# Altium project EL.T01.MBRD.PrjPcb (part 2 of 2)

## Sheet WideRangeVoltmeter.SchDoc
size A4; SheetNumber: 8; SheetTotal: 8
Used 2 times, as channels Voltmetr, CellVoltage/Voltmetr. Parts and nets are listed once, with the designators drawn on the sheet.
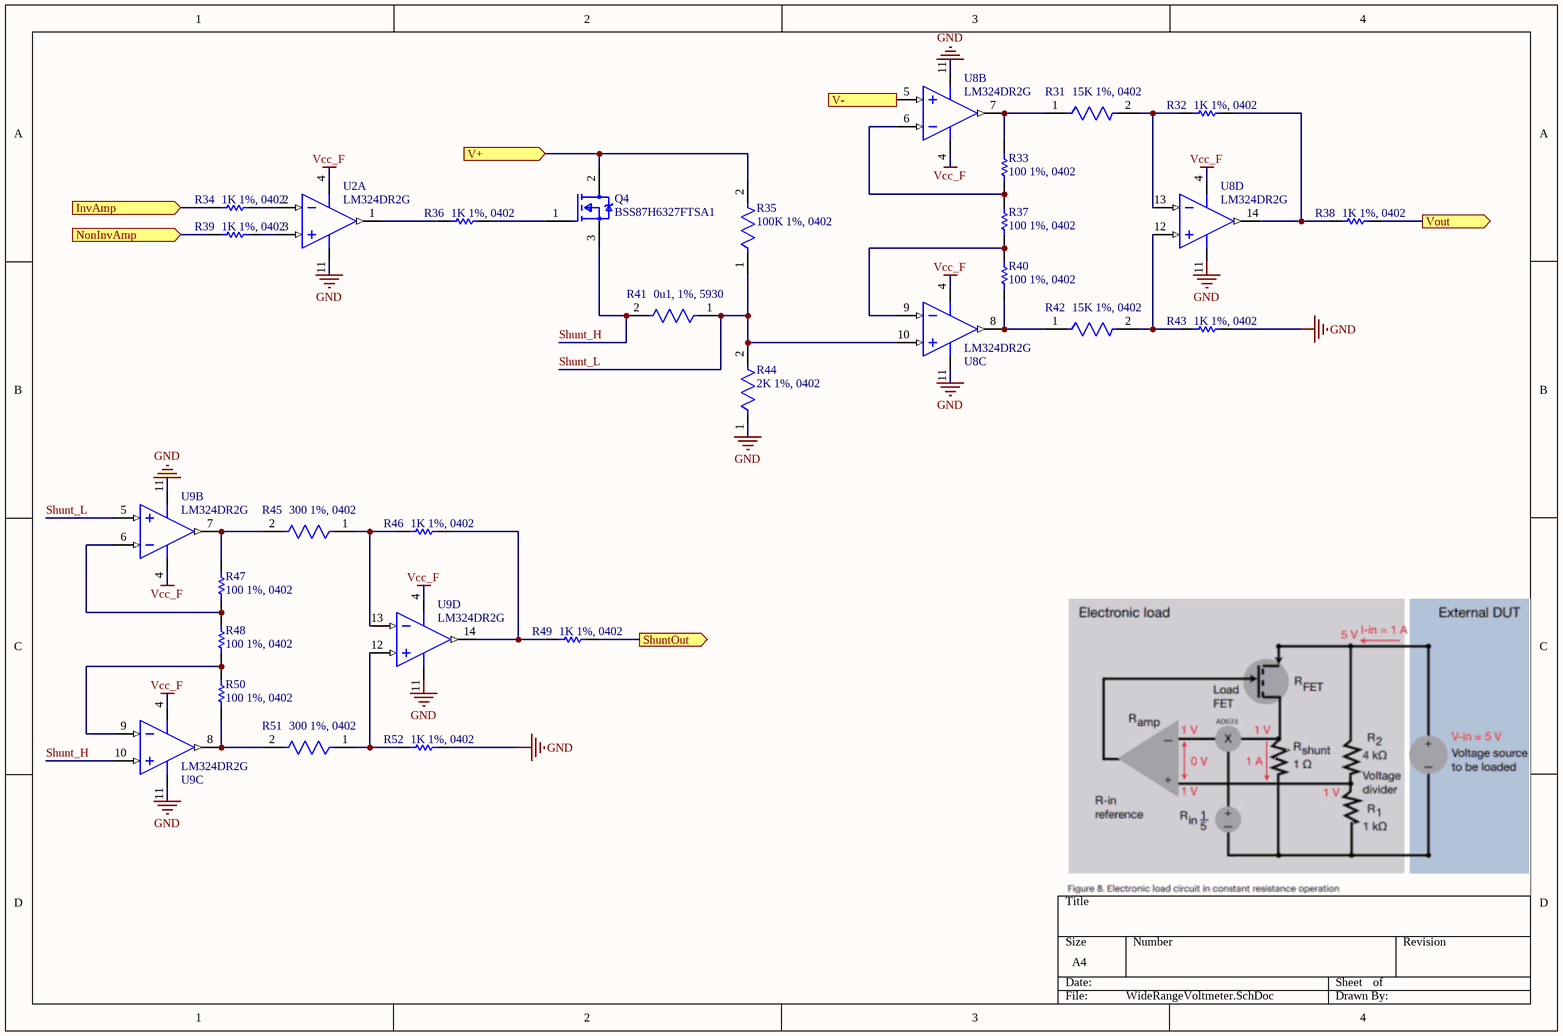
[diagram p4: WideRangeVoltmeter.SchDoc]

### Parts
Q4  BSS87H6327FTSA1  [FP-PG-SOT89-4-MFG]
R31  15K 1%, 0402  [FP-ERJ2R-MFG]
R32  1K 1%, 0402  [RESC1005X40X25NL05T05]
R33  100 1%, 0402  [RESC1005X40X25LL05T05]
R34  1K 1%, 0402  [RESC1005X40X25NL05T05]
R35  100K 1%, 0402  [FP-ERJ2RK-IPC_C]
R36  1K 1%, 0402  [RESC1005X40X25NL05T05]
R37  100 1%, 0402  [RESC1005X40X25LL05T05]
R38  1K 1%, 0402  [RESC1005X40X25NL05T05]
R39  1K 1%, 0402  [RESC1005X40X25NL05T05]
R40  100 1%, 0402  [RESC1005X40X25LL05T05]
R41  0u1, 1%, 5930  [FP-CSS2H-5930K-1L00F-MFG]
R42  15K 1%, 0402  [FP-ERJ2R-MFG]
R43  1K 1%, 0402  [RESC1005X40X25NL05T05]
R44  2K 1%, 0402  [FP-ERJ2RK-MFG]
R45  300 1%, 0402  [FP-ERJ2RK-IPC_A]
R46  1K 1%, 0402  [RESC1005X40X25NL05T05]
R47  100 1%, 0402  [RESC1005X40X25LL05T05]
R48  100 1%, 0402  [RESC1005X40X25LL05T05]
R49  1K 1%, 0402  [RESC1005X40X25NL05T05]
R50  100 1%, 0402  [RESC1005X40X25LL05T05]
R51  300 1%, 0402  [FP-ERJ2RK-IPC_A]
R52  1K 1%, 0402  [RESC1005X40X25NL05T05]
U2  LM324DR2G  [ONSC-SOIC-14-751A-03_V]  (part A of 4)
U8  LM324DR2G  [ONSC-SOIC-14-751A-03_V]  (parts B,C,D of 4)
U9  LM324DR2G  [ONSC-SOIC-14-751A-03_V]  (parts B,C,D of 4)

### Ports
InvAmp (in, see MainBoard[2A], CellVoltageControl[1C]), NonInvAmp (in, see MainBoard[2A], CellVoltageControl[1C]), ShuntOut (out), V+ (in, see MainBoard[3A]), V- (in, see MainBoard[3A]), Vout (out, see MainBoard[3A], CellVoltageControl[2B])

### Nets
GND: R43.2 R44.1 R52.2 U2.11(VEE/GND) U8.11(VEE/GND) U9.11(VEE/GND)
Vcc_F: U2.4(VCC) U8.4(VCC) U9.4(VCC)
InvAmp: R34.1 ; port InvAmp
NonInvAmp: R39.1 ; port NonInvAmp
Shunt_H: Q4.3(Source) R41.2 U9.10(IN3+)
Shunt_L: R35.1 R41.1 R44.2 U8.10(IN3+) U9.5(IN2+)
ShuntOut: R49.2 ; port ShuntOut
V+: Q4.2(Drain) R35.2 ; port V+
V-: U8.5(IN2+) ; port V-
Vout: R38.2 ; port Vout
NetQ4_1: Q4.1(Gate) R36.2
NetR31_1: R31.1 R33.2 U8.7(OUT2)
NetR31_2: R31.2 R32.1 U8.13(IN4-)
NetR32_2: R32.2 R38.1 U8.14(OUT4)
NetR33_1: R33.1 R37.2 U8.6(IN2-)
NetR34_2: R34.2 U2.2(IN1-)
NetR36_1: R36.1 U2.1(OUT1)
NetR37_1: R37.1 R40.2 U8.9(IN3-)
NetR39_2: R39.2 U2.3(IN1+)
NetR40_1: R40.1 R42.1 U8.8(OUT3)
NetR42_2: R42.2 R43.1 U8.12(IN4+)
NetR45_1: R45.1 R46.1 U9.13(IN4-)
NetR45_2: R45.2 R47.2 U9.7(OUT2)
NetR46_2: R46.2 R49.1 U9.14(OUT4)
NetR47_1: R47.1 R48.2 U9.6(IN2-)
NetR48_1: R48.1 R50.2 U9.9(IN3-)
NetR50_1: R50.1 R51.2 U9.8(OUT3)
NetR51_1: R51.1 R52.1 U9.12(IN4+)

### Channels
Voltmetr: designators end in _Voltmetr; ports InvAmp=NetR34_Voltmetr_1 NonInvAmp=NetR39_Voltmetr_1 ShuntOut=NetR49_Voltmetr_2 V+=NetQ4_Voltmetr_2 V-=NetU8_Voltmetr_5 Vout=NetR38_Voltmetr_2
CellVoltage/Voltmetr: designators end in _CellVoltage_Voltmetr; ports InvAmp=NetR34_CellVoltage_Voltmetr_1 NonInvAmp=NetR39_CellVoltage_Voltmetr_1 ShuntOut=NetR49_CellVoltage_Voltmetr_2 V+=V+ V-=GND Vout=NetR38_CellVoltage_Voltmetr_2

### Notes on the sheet
- Labels drawn without touching a wire or pin: GND

### Library data of the parts
Q4 = CMP-32901-001322-1: MOSFET N-CH 240V 260MA SOT89-4; Input Capacitance: 97pF; Drain to Source Resistance: 3.9R; Rise Time: 3.5ns; Rds On Max: 6R; Fall Time: 27.3ns; Turn-On Delay Time: 3.7ns; Number of Elements: 1; Power Dissipation: 1W; Element Configuration: Single; Gate to Source Voltage (Vgs): 20V; Polarity: N-CHANNEL; Turn-Off Delay Time: 17.6ns; Case/Package: SOT-89; Max Dual Supply Voltage: 240V; Drain to Source Voltage (Vdss): 240V; Lead Free: Lead Free; Package Quantity: 1000; Halogen Free: Not Halogen Free; RoHS Compliant: Yes; Width: 2.5mm; Length: 4.5mm; Mount: Surface Mount; Packaging: Tape and Reel; Max Power Dissipation: 1W; Height: 1.5mm; Max Operating Temperature: 150°C; Series: SIPMOS®; Drain to Source Breakdown Voltage: 240V; Min Operating Temperature: -55°C; Number of Pins: 3; Continuous Drain Current (ID): 260mA
R31 R42 = CMP-2002-00694-4: RES SMD 15K OHM 1% 1/10W 0402; Manufacturer Part Number: ERJ-2RKF1502X; Manufacturer: Panasonic; Automotive Grade: Grade 0; Voltage Rating: 50V; Resistance: 15kΩ; Temperature Coefficient: 100ppm/°C; Power Rating: 0.1W; Value: 15kΩ; ComponentLink2URL: https://industrial.panasonic.com/cdbs/www-data/pdf/RDA0000/AOA0000C304.pdf; Automotive: Yes; Temperature: -55°C to +155°C; Height: 0.4mm; Digikey Description: RES SMD 15K OHM 1% 1/10W 0402; Category: Res; Device Class L2: Resistors; Device Class L1: Passive Components; Package: ERJ2R; Temperature Range Low: -55°C; Tolerance: 1%; Series: ERJ; Footprint Url: https://b2b-api.panasonic.eu/file_stream/pids/fileversion/1180; Mouser Description: Res Thick Film 1.0 x 0.5 mm 15K Ohm 1% 0.1W(1/10W) 100ppm/ C Molded SMD Punched Carrier T/R; Composition: Thick Film; Lead Free: Yes; Device Class L3: Chip SMD Resistors; Octopart: https://octopart.com/erj-2rkf1502x-panasonic-55404985; RoHS: TRUE; Temperature Range High: +155°C; ComponentLink2Description: Datasheet
R32 R34 R36 R38 R39 R43 R46 R49 R52 = CMP-1011-00510-4: Chip Resistor, 1 KOhm, +/- 1%, 100 mW, -55 to 155 degC, 0402 (1005 Metric), RoHS, Tape and Reel; PartNumber: ERJ-2RKF1001X; Manufacturer: Basic Passives; Voltage Rating: 50 V; Case\/Package: 0402; Resistance: 1 KOhm; Power Rating: 100 mW; DatasheetVersion: 04/2015; Radiation Hardening: No; Pins: 2; Height: 0.35 mm; RoHSCompliant: true; Case Code (Imperial): 0402; ComponentLink2Description: Datasheet; ComponentLink1Description: Manufacturer URL; PackageReference: 0402; Mount: Surface Mount; Package Quantity: 10000; Tolerance: 1%; ComponentLink1URL: http://www.panasonic.com/; PackageDescription: 2-Pin Surface Mount Device, Body 1 x 0.5 mm; Mounting Technology: Surface Mount; Case Code (Metric): 1005; ComponentLink2URL: http://industrial.panasonic.com/cdbs/www-data/pdf/RDA0000/AOA0000C86.pdf; REACH SVHC: Yes; Packaging: Tape and Reel; Max Operating Temperature: 155 degC; Min Operating Temperature: -55 degC; Width: 0.5 mm; Length: 1 mm
R33 R37 R40 R47 R48 R50 = CMP-2002-00605-3: Chip Resistor, 100 Ohm, +/- 1%, 100 mW, -55 to 155 degC, 0402 (1005 Metric), RoHS, Tape and Reel; Manufacturer: Basic Passives; PartNumber: ERJ-2RKF1000X; Power Rating: 100 mW; Resistance: 100 Ohm; Voltage Rating: 50 V; Case\/Package: 0402; Width: 0.5 mm; Pins: 2; ComponentLink2Description: Datasheet; PackageReference: 0402; Height: 0.35 mm; Tolerance: 1%; DatasheetVersion: 04/2015; Case Code (Imperial): 0402; Min Operating Temperature: -55 degC; Radiation Hardening: No; Length: 1 mm; Package Quantity: 10000; PackageDescription: 2-Pin Surface Mount Device, Body 1 x 0.5 mm; Mounting Technology: Surface Mount; Case Code (Metric): 1005; Packaging: Tape and Reel; ComponentLink1URL: http://www.panasonic.com/; RoHSCompliant: true; Max Operating Temperature: 155 degC; REACH SVHC: Yes; ComponentLink1Description: Manufacturer URL; ComponentLink2URL: http://industrial.panasonic.com/cdbs/www-data/pdf/RDA0000/AOA0000C86.pdf; Mount: Surface Mount
R35 = CMP-2002-00608-4: RES SMD 100K OHM 1% 1/10W 0402; Resistance: 100kR; Voltage Rating (DC): 50V; Power Rating: 100mW; Temperature Coefficient: 100ppm/°C; Case/Package: 0402; Length: 1mm; Package Quantity: 1; Radiation Hardening: No; Case Code (Metric): 1005; Contact Plating: Tin; Mount: Surface Mount; Depth: 0.5mm; Max Operating Temperature: 155°C; Lead Free: Lead Free; Width: 0.5mm; Composition: Thick Film; Case Code (Imperial): 0402; Tolerance: 1%; Termination: SMD/SMT; Number of Pins: 2; Height: 0.35mm; Voltage Rating: 50V; Military Standard: Not; REACH SVHC: No SVHC; Packaging: Tape and Reel; Min Operating Temperature: -55°C; Max Power Dissipation: 100mW; Features: Automotive AEC-Q200; Number of Terminations: 2
R41 = CMP-00059-73869598-1: CSS2H-5930K-1L00F Res Metal Strip 5930 0.001 Ohm 1% 9W ±50ppm/C Pad SMD Automotive T/R; Resistance: 1mΩ; Temperature Coefficient: 50ppm/°C; Case Code (Imperial): 5931; Width: 7.747mm; Min Operating Temperature: -55°C; Tolerance: 1%; Max Power Dissipation: 9W; Case Code (Metric): 1577; Max Operating Temperature: 170°C; NexarPartId: 73869598; Power Rating: 9W; Composition: Metal Element; Case/Package: 5930; Height: 939.8µm; Number of Terminations: 2; Schedule B: 8533210045, 8533210045; Packaging: Cut Tape; REACH SVHC: No SVHC; Features: Moisture Resistant; RoHS: Compliant; Length: 15.0114mm
R44 = CMP-2002-00758-4: RES SMD 2K OHM 1% 1/10W 0402; Temperature Coefficient: 100ppm/°C; Max Power Dissipation: 100mW; Working Voltage: 50V; Resistance: 2kR; Number of Terminations: 2; Technology: THICK FILM; Packaging: Tape and Reel; RoHS Compliant: Yes; Min Operating Temperature: -55°C; Length: 1mm; Construction: Rectangular; Features: Automotive AEC-Q200; Contact Plating: Tin; Lead Free: Lead Free; Series: ERJ; Power Rating: 100mW; REACH SVHC: No SVHC; Resistor Type: Thick Film; Max Operating Temperature: 155°C; Package Quantity: 10000; Height: 0.35mm; Case/Package: 0402; Tolerance: 1%; Mount: Surface Mount; Termination: SMD/SMT; Resistance Tolerance: 1%; Depth: 0.5mm; Voltage Rating (DC): 50V; Voltage Rating: 50V; Case Code (Imperial): 0402; Military Standard: Not; Width: 0.02inch; Radiation Hardening: No; Case Code (Metric): 1005
R45 R51 = CMP-1011-00449-3: RES SMD 300 OHM 1% 1/10W 0402; Power Rating: 100mW; Voltage Rating: 50V; Temperature Coefficient: 100ppm/°C; Resistance: 300R; Case Code (Imperial): 0402; Termination: SMD/SMT; REACH SVHC: No SVHC; Number of Terminations: 2; Composition: Thick Film; Case Code (Metric): 1005; Voltage Rating (DC): 50V; Packaging: Tape and Reel; Max Power Dissipation: 100mW; Tolerance: 1%; Lead Free: Lead Free; Military Standard: Not; Mount: Surface Mount; Height: 0.35mm; Package Quantity: 10000; Max Operating Temperature: 155°C; Depth: 0.5mm; Min Operating Temperature: -55°C; Length: 1mm; Contact Plating: Tin; Width: 0.02inch; Case/Package: 0402
U2 U8 U9 = CMP-1310-00171-1: Single Supply Quad Operational Amplifier, 3 to 32 V, 0 to 70 degC, 14-Pin SOIC, Pb-Free, Tape and Reel; Manufacturer: On Semiconductor; VCC Max (V): 32; VCC Min (V): 3; PackageVersion: Rev. K, 05/2011; ComponentLink3URL: http://www.onsemi.com/pub_link/Collateral/751A-03.PDF; ComponentLink3Description: Package Specification; Packing: Tape and Reel; ComponentLink2URL: http://www.onsemi.cn/pub_link/Collateral/LM324-D.PDF; PackageReference: SOIC-14-751A-03; ComponentLink1URL: http://www.onsemi.com/; PackageDescription: 14-Pin Small Outline Integrated Circuit, Body 8.65 x 3.9 mm, Pitch 1.27 mm; ComponentLink1Description: Manufacturer URL; DatasheetVersion: Rev. 25; Mounting Technology: Surface Mount; RoHS: TRUE; ComponentLink2Description: Datasheet; PartNumber: LM324DR2G

## Sheet CellVoltageControl.SchDoc
size A4; SheetNumber: 5; SheetTotal: 8
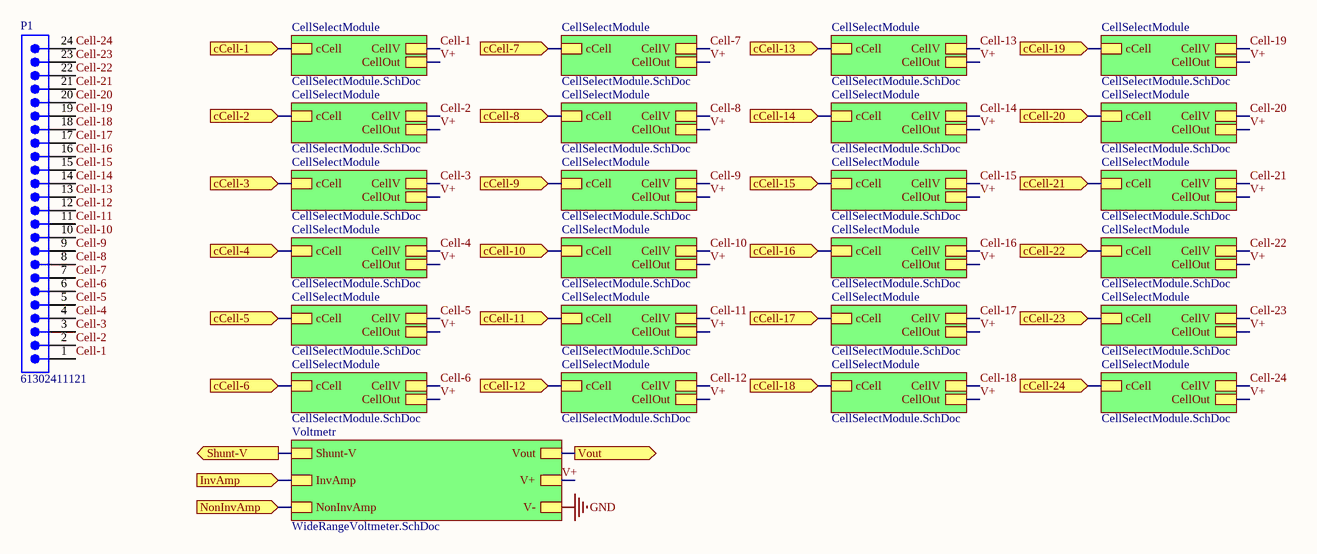
[diagram p5: CellVoltageControl.SchDoc]

### Parts
P1  61302411121  [61302411121]

### Sub-sheets
CellSelectModule = CellSelectModule.SchDoc: cCell, CellV, CellOut
CellSelectModule = CellSelectModule.SchDoc: cCell, CellV, CellOut
CellSelectModule = CellSelectModule.SchDoc: cCell, CellV, CellOut
CellSelectModule = CellSelectModule.SchDoc: cCell, CellV, CellOut
CellSelectModule = CellSelectModule.SchDoc: cCell, CellV, CellOut
CellSelectModule = CellSelectModule.SchDoc: cCell, CellV, CellOut
CellSelectModule = CellSelectModule.SchDoc: cCell, CellV, CellOut
CellSelectModule = CellSelectModule.SchDoc: cCell, CellV, CellOut
CellSelectModule = CellSelectModule.SchDoc: cCell, CellV, CellOut
CellSelectModule = CellSelectModule.SchDoc: cCell, CellV, CellOut
CellSelectModule = CellSelectModule.SchDoc: cCell, CellV, CellOut
CellSelectModule = CellSelectModule.SchDoc: cCell, CellV, CellOut
CellSelectModule = CellSelectModule.SchDoc: cCell, CellV, CellOut
CellSelectModule = CellSelectModule.SchDoc: cCell, CellV, CellOut
CellSelectModule = CellSelectModule.SchDoc: cCell, CellV, CellOut
CellSelectModule = CellSelectModule.SchDoc: cCell, CellV, CellOut
CellSelectModule = CellSelectModule.SchDoc: cCell, CellV, CellOut
CellSelectModule = CellSelectModule.SchDoc: cCell, CellV, CellOut
CellSelectModule = CellSelectModule.SchDoc: cCell, CellV, CellOut
CellSelectModule = CellSelectModule.SchDoc: cCell, CellV, CellOut
CellSelectModule = CellSelectModule.SchDoc: cCell, CellV, CellOut
CellSelectModule = CellSelectModule.SchDoc: cCell, CellV, CellOut
CellSelectModule = CellSelectModule.SchDoc: cCell, CellV, CellOut
CellSelectModule = CellSelectModule.SchDoc: cCell, CellV, CellOut
Voltmetr = WideRangeVoltmeter.SchDoc: InvAmp, NonInvAmp, V-, V+, Shunt-V, Vout

### Ports
cCell-1 (in, see MainBoard[3A]), cCell-2 (in, see MainBoard[3A]), cCell-3 (in, see MainBoard[3A]), cCell-4 (in, see MainBoard[3A]), cCell-5 (in, see MainBoard[3A]), cCell-6 (in, see MainBoard[3A]), cCell-7 (in, see MainBoard[3A]), cCell-8 (in, see MainBoard[3A]), cCell-9 (in, see MainBoard[3A]), cCell-10 (in, see MainBoard[3A]), cCell-11 (in, see MainBoard[3A]), cCell-12 (in, see MainBoard[3A]), cCell-13 (in, see MainBoard[4A]), cCell-14 (in, see MainBoard[4A]), cCell-15 (in, see MainBoard[4A]), cCell-16 (in, see MainBoard[4A]), cCell-17 (in, see MainBoard[4A]), cCell-18 (in, see MainBoard[4A]), cCell-19 (in, see MainBoard[4A]), cCell-20 (in, see MainBoard[4A]), cCell-21 (in, see MainBoard[4A]), cCell-22 (in, see MainBoard[4A]), cCell-23 (in, see MainBoard[4A]), cCell-24 (in, see MainBoard[4A]), InvAmp (in, see MainBoard[3A], WideRangeVoltmeter[1A]), NonInvAmp (in, see MainBoard[3A], WideRangeVoltmeter[1A]), Shunt-V (out, see MainBoard[3A]), Vout (out, see MainBoard[4A], WideRangeVoltmeter[4A])

### Nets
Cell-1: P1.1 ; sheet CellSelectModule/CellV
Cell-2: P1.2 ; sheet CellSelectModule/CellV
Cell-3: P1.3 ; sheet CellSelectModule/CellV
Cell-4: P1.4 ; sheet CellSelectModule/CellV
Cell-5: P1.5 ; sheet CellSelectModule/CellV
Cell-6: P1.6 ; sheet CellSelectModule/CellV
Cell-7: P1.7 ; sheet CellSelectModule/CellV
Cell-8: P1.8 ; sheet CellSelectModule/CellV
Cell-9: P1.9 ; sheet CellSelectModule/CellV
Cell-10: P1.10 ; sheet CellSelectModule/CellV
Cell-11: P1.11 ; sheet CellSelectModule/CellV
Cell-12: P1.12 ; sheet CellSelectModule/CellV
Cell-13: P1.13 ; sheet CellSelectModule/CellV
Cell-14: P1.14 ; sheet CellSelectModule/CellV
Cell-15: P1.15 ; sheet CellSelectModule/CellV
Cell-16: P1.16 ; sheet CellSelectModule/CellV
Cell-17: P1.17 ; sheet CellSelectModule/CellV
Cell-18: P1.18 ; sheet CellSelectModule/CellV
Cell-19: P1.19 ; sheet CellSelectModule/CellV
Cell-20: P1.20 ; sheet CellSelectModule/CellV
Cell-21: P1.21 ; sheet CellSelectModule/CellV
Cell-22: P1.22 ; sheet CellSelectModule/CellV
Cell-23: P1.23 ; sheet CellSelectModule/CellV
Cell-24: P1.24 ; sheet CellSelectModule/CellV
V+: sheet Voltmetr/V+, sheet CellSelectModule/CellOut, sheet CellSelectModule/CellOut, sheet CellSelectModule/CellOut, sheet CellSelectModule/CellOut, sheet CellSelectModule/CellOut, sheet CellSelectModule/CellOut, sheet CellSelectModule/CellOut, sheet CellSelectModule/CellOut, sheet CellSelectModule/CellOut, sheet CellSelectModule/CellOut, sheet CellSelectModule/CellOut, sheet CellSelectModule/CellOut, sheet CellSelectModule/CellOut, sheet CellSelectModule/CellOut, sheet CellSelectModule/CellOut, sheet CellSelectModule/CellOut, sheet CellSelectModule/CellOut, sheet CellSelectModule/CellOut, sheet CellSelectModule/CellOut, sheet CellSelectModule/CellOut, sheet CellSelectModule/CellOut, sheet CellSelectModule/CellOut, sheet CellSelectModule/CellOut, sheet CellSelectModule/CellOut
NetR34_CellVoltage_Voltmetr_1: port InvAmp, sheet Voltmetr/InvAmp
NetR38_CellVoltage_Voltmetr_2: port Vout, sheet Voltmetr/Vout
NetR39_CellVoltage_Voltmetr_1: port NonInvAmp, sheet Voltmetr/NonInvAmp
NetR53_CellVoltage_CellSelectModule#1_2: port cCell-1, sheet CellSelectModule/cCell
NetR53_CellVoltage_CellSelectModule#2_2: port cCell-2, sheet CellSelectModule/cCell
NetR53_CellVoltage_CellSelectModule#3_2: port cCell-3, sheet CellSelectModule/cCell
NetR53_CellVoltage_CellSelectModule#4_2: port cCell-4, sheet CellSelectModule/cCell
NetR53_CellVoltage_CellSelectModule#5_2: port cCell-5, sheet CellSelectModule/cCell
NetR53_CellVoltage_CellSelectModule#6_2: port cCell-6, sheet CellSelectModule/cCell
NetR53_CellVoltage_CellSelectModule#7_2: port cCell-7, sheet CellSelectModule/cCell
NetR53_CellVoltage_CellSelectModule#8_2: port cCell-8, sheet CellSelectModule/cCell
NetR53_CellVoltage_CellSelectModule#9_2: port cCell-9, sheet CellSelectModule/cCell
NetR53_CellVoltage_CellSelectModule#10_2: port cCell-10, sheet CellSelectModule/cCell
NetR53_CellVoltage_CellSelectModule#11_2: port cCell-11, sheet CellSelectModule/cCell
NetR53_CellVoltage_CellSelectModule#12_2: port cCell-12, sheet CellSelectModule/cCell
NetR53_CellVoltage_CellSelectModule#13_2: port cCell-13, sheet CellSelectModule/cCell
NetR53_CellVoltage_CellSelectModule#14_2: port cCell-14, sheet CellSelectModule/cCell
NetR53_CellVoltage_CellSelectModule#15_2: port cCell-15, sheet CellSelectModule/cCell
NetR53_CellVoltage_CellSelectModule#16_2: port cCell-16, sheet CellSelectModule/cCell
NetR53_CellVoltage_CellSelectModule#17_2: port cCell-17, sheet CellSelectModule/cCell
NetR53_CellVoltage_CellSelectModule#18_2: port cCell-18, sheet CellSelectModule/cCell
NetR53_CellVoltage_CellSelectModule#19_2: port cCell-19, sheet CellSelectModule/cCell
NetR53_CellVoltage_CellSelectModule#20_2: port cCell-20, sheet CellSelectModule/cCell
NetR53_CellVoltage_CellSelectModule#21_2: port cCell-21, sheet CellSelectModule/cCell
NetR53_CellVoltage_CellSelectModule#22_2: port cCell-22, sheet CellSelectModule/cCell
NetR53_CellVoltage_CellSelectModule#23_2: port cCell-23, sheet CellSelectModule/cCell
NetR53_CellVoltage_CellSelectModule#24_2: port cCell-24, sheet CellSelectModule/cCell
(unnamed): port Shunt-V, sheet Voltmetr/Shunt-V

### Library data of the parts
P1 = CMP-1502-01109-3: NexarPartId: 32855561; Pitch: 2.54mm; Contact Resistance: 20mΩ; Operating Supply Voltage: 250V; Current Rating: 3A; Gender: Male; Connector Type: Male Pin; Number of Positions: 24; Packaging: Bulk; Lead Pitch: 2.54mm; Number of Pins: 24; Orientation: Vertical; Contact Material: Copper; REACH SVHC: Unknown; Color: Black; Mount: Through Hole; Contact Plating: Gold; Contact Mating Length: 5.9944mm; RoHS: Compliant; Termination: Solder; Number of Rows: 1; Number of Contacts: 24

## Sheet CellSelectModule.SchDoc
size A4; SheetNumber: 3; SheetTotal: 8
Used 24 times, as channels CellVoltage/CellSelectModule, CellVoltage/CellSelectModule, CellVoltage/CellSelectModule, CellVoltage/CellSelectModule, CellVoltage/CellSelectModule, CellVoltage/CellSelectModule, CellVoltage/CellSelectModule, CellVoltage/CellSelectModule, CellVoltage/CellSelectModule, CellVoltage/CellSelectModule, CellVoltage/CellSelectModule, CellVoltage/CellSelectModule, CellVoltage/CellSelectModule, CellVoltage/CellSelectModule, CellVoltage/CellSelectModule, CellVoltage/CellSelectModule, CellVoltage/CellSelectModule, CellVoltage/CellSelectModule, CellVoltage/CellSelectModule, CellVoltage/CellSelectModule, CellVoltage/CellSelectModule, CellVoltage/CellSelectModule, CellVoltage/CellSelectModule, CellVoltage/CellSelectModule. Parts and nets are listed once, with the designators drawn on the sheet.
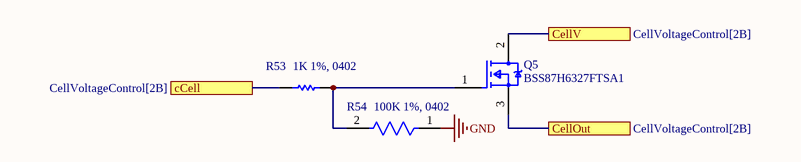
[diagram p6: CellSelectModule.SchDoc]

### Parts
Q5  BSS87H6327FTSA1  [FP-PG-SOT89-4-MFG]
R53  1K 1%, 0402  [RESC1005X40X25NL05T05]
R54  100K 1%, 0402  [FP-ERJ2RK-IPC_C]

### Ports
cCell (see CellVoltageControl[2B]), CellOut (see CellVoltageControl[2B]), CellV (see CellVoltageControl[2B])

### Nets
GND: R54.1
cCell: R53.2 ; port cCell
CellOut: Q5.3(Source) ; port CellOut
CellV: Q5.2(Drain) ; port CellV
NetQ5_1: Q5.1(Gate) R53.1 R54.2

### Channels
CellVoltage/CellSelectModule: designators end in _CellVoltage_CellSelectModule#1; ports cCell=NetR53_CellVoltage_CellSelectModule#1_2 CellOut=V+ CellV=Cell-1
CellVoltage/CellSelectModule: designators end in _CellVoltage_CellSelectModule#2; ports cCell=NetR53_CellVoltage_CellSelectModule#2_2 CellOut=V+ CellV=Cell-2
CellVoltage/CellSelectModule: designators end in _CellVoltage_CellSelectModule#3; ports cCell=NetR53_CellVoltage_CellSelectModule#3_2 CellOut=V+ CellV=Cell-3
CellVoltage/CellSelectModule: designators end in _CellVoltage_CellSelectModule#4; ports cCell=NetR53_CellVoltage_CellSelectModule#4_2 CellOut=V+ CellV=Cell-4
CellVoltage/CellSelectModule: designators end in _CellVoltage_CellSelectModule#5; ports cCell=NetR53_CellVoltage_CellSelectModule#5_2 CellOut=V+ CellV=Cell-5
CellVoltage/CellSelectModule: designators end in _CellVoltage_CellSelectModule#6; ports cCell=NetR53_CellVoltage_CellSelectModule#6_2 CellOut=V+ CellV=Cell-6
CellVoltage/CellSelectModule: designators end in _CellVoltage_CellSelectModule#7; ports cCell=NetR53_CellVoltage_CellSelectModule#7_2 CellOut=V+ CellV=Cell-7
CellVoltage/CellSelectModule: designators end in _CellVoltage_CellSelectModule#8; ports cCell=NetR53_CellVoltage_CellSelectModule#8_2 CellOut=V+ CellV=Cell-8
CellVoltage/CellSelectModule: designators end in _CellVoltage_CellSelectModule#9; ports cCell=NetR53_CellVoltage_CellSelectModule#9_2 CellOut=V+ CellV=Cell-9
CellVoltage/CellSelectModule: designators end in _CellVoltage_CellSelectModule#10; ports cCell=NetR53_CellVoltage_CellSelectModule#10_2 CellOut=V+ CellV=Cell-10
CellVoltage/CellSelectModule: designators end in _CellVoltage_CellSelectModule#11; ports cCell=NetR53_CellVoltage_CellSelectModule#11_2 CellOut=V+ CellV=Cell-11
CellVoltage/CellSelectModule: designators end in _CellVoltage_CellSelectModule#12; ports cCell=NetR53_CellVoltage_CellSelectModule#12_2 CellOut=V+ CellV=Cell-12
CellVoltage/CellSelectModule: designators end in _CellVoltage_CellSelectModule#13; ports cCell=NetR53_CellVoltage_CellSelectModule#13_2 CellOut=V+ CellV=Cell-13
CellVoltage/CellSelectModule: designators end in _CellVoltage_CellSelectModule#14; ports cCell=NetR53_CellVoltage_CellSelectModule#14_2 CellOut=V+ CellV=Cell-14
CellVoltage/CellSelectModule: designators end in _CellVoltage_CellSelectModule#15; ports cCell=NetR53_CellVoltage_CellSelectModule#15_2 CellOut=V+ CellV=Cell-15
CellVoltage/CellSelectModule: designators end in _CellVoltage_CellSelectModule#16; ports cCell=NetR53_CellVoltage_CellSelectModule#16_2 CellOut=V+ CellV=Cell-16
CellVoltage/CellSelectModule: designators end in _CellVoltage_CellSelectModule#17; ports cCell=NetR53_CellVoltage_CellSelectModule#17_2 CellOut=V+ CellV=Cell-17
CellVoltage/CellSelectModule: designators end in _CellVoltage_CellSelectModule#18; ports cCell=NetR53_CellVoltage_CellSelectModule#18_2 CellOut=V+ CellV=Cell-18
CellVoltage/CellSelectModule: designators end in _CellVoltage_CellSelectModule#19; ports cCell=NetR53_CellVoltage_CellSelectModule#19_2 CellOut=V+ CellV=Cell-19
CellVoltage/CellSelectModule: designators end in _CellVoltage_CellSelectModule#20; ports cCell=NetR53_CellVoltage_CellSelectModule#20_2 CellOut=V+ CellV=Cell-20
CellVoltage/CellSelectModule: designators end in _CellVoltage_CellSelectModule#21; ports cCell=NetR53_CellVoltage_CellSelectModule#21_2 CellOut=V+ CellV=Cell-21
CellVoltage/CellSelectModule: designators end in _CellVoltage_CellSelectModule#22; ports cCell=NetR53_CellVoltage_CellSelectModule#22_2 CellOut=V+ CellV=Cell-22
CellVoltage/CellSelectModule: designators end in _CellVoltage_CellSelectModule#23; ports cCell=NetR53_CellVoltage_CellSelectModule#23_2 CellOut=V+ CellV=Cell-23
CellVoltage/CellSelectModule: designators end in _CellVoltage_CellSelectModule#24; ports cCell=NetR53_CellVoltage_CellSelectModule#24_2 CellOut=V+ CellV=Cell-24

### Library data of the parts
Q5 = CMP-32901-001322-1: as Q4 on sheet WideRangeVoltmeter; Case/Package: SOT-89; Max Dual Supply Voltage: 240V; Drain to Source Voltage (Vdss): 240V; Lead Free: Lead Free; Package Quantity: 1000; Halogen Free: Not Halogen Free; RoHS Compliant: Yes; Width: 2.5mm; Length: 4.5mm; Mount: Surface Mount; Packaging: Tape and Reel; Max Power Dissipation: 1W; Height: 1.5mm; Max Operating Temperature: 150°C; Series: SIPMOS®; Drain to Source Breakdown Voltage: 240V; Min Operating Temperature: -55°C; Number of Pins: 3; Continuous Drain Current (ID): 260mA
R53 = CMP-1011-00510-4: as R32 on sheet WideRangeVoltmeter; DatasheetVersion: 04/2015; Radiation Hardening: No; Pins: 2; Height: 0.35 mm; RoHSCompliant: true; Case Code (Imperial): 0402; ComponentLink2Description: Datasheet; ComponentLink1Description: Manufacturer URL; PackageReference: 0402; Mount: Surface Mount; Package Quantity: 10000; Tolerance: 1%; ComponentLink1URL: http://www.panasonic.com/; PackageDescription: 2-Pin Surface Mount Device, Body 1 x 0.5 mm; Mounting Technology: Surface Mount; Case Code (Metric): 1005; ComponentLink2URL: http://industrial.panasonic.com/cdbs/www-data/pdf/RDA0000/AOA0000C86.pdf; REACH SVHC: Yes; Packaging: Tape and Reel; Max Operating Temperature: 155 degC; Min Operating Temperature: -55 degC; Width: 0.5 mm; Length: 1 mm
R54 = CMP-2002-00608-4: as R35 on sheet WideRangeVoltmeter; Case/Package: 0402; Length: 1mm; Package Quantity: 1; Radiation Hardening: No; Case Code (Metric): 1005; Contact Plating: Tin; Mount: Surface Mount; Depth: 0.5mm; Max Operating Temperature: 155°C; Lead Free: Lead Free; Width: 0.5mm; Composition: Thick Film; Case Code (Imperial): 0402; Tolerance: 1%; Termination: SMD/SMT; Number of Pins: 2; Height: 0.35mm; Voltage Rating: 50V; Military Standard: Not; REACH SVHC: No SVHC; Packaging: Tape and Reel; Min Operating Temperature: -55°C; Max Power Dissipation: 100mW; Features: Automotive AEC-Q200; Number of Terminations: 2

## Nets that join several sheets
GND: DiffAmp_K-0.2 (R17.2 U1.11), DiffAmp_K-10 (R25.2 U2.11), MainBoard (37 pins), MainShunt (15 pins), Voltmetr (6 pins), CellVoltage/Voltmetr (7 pins), CellVoltage/CellSelectModule (R54_CellVoltage_CellSelectModule#1.1), CellVoltage/CellSelectModule (R54_CellVoltage_CellSelectModule#2.1), CellVoltage/CellSelectModule (R54_CellVoltage_CellSelectModule#3.1), CellVoltage/CellSelectModule (R54_CellVoltage_CellSelectModule#4.1), CellVoltage/CellSelectModule (R54_CellVoltage_CellSelectModule#5.1), CellVoltage/CellSelectModule (R54_CellVoltage_CellSelectModule#6.1), CellVoltage/CellSelectModule (R54_CellVoltage_CellSelectModule#7.1), CellVoltage/CellSelectModule (R54_CellVoltage_CellSelectModule#8.1), CellVoltage/CellSelectModule (R54_CellVoltage_CellSelectModule#9.1), CellVoltage/CellSelectModule (R54_CellVoltage_CellSelectModule#10.1), CellVoltage/CellSelectModule (R54_CellVoltage_CellSelectModule#11.1), CellVoltage/CellSelectModule (R54_CellVoltage_CellSelectModule#12.1), CellVoltage/CellSelectModule (R54_CellVoltage_CellSelectModule#13.1), CellVoltage/CellSelectModule (R54_CellVoltage_CellSelectModule#14.1), CellVoltage/CellSelectModule (R54_CellVoltage_CellSelectModule#15.1), CellVoltage/CellSelectModule (R54_CellVoltage_CellSelectModule#16.1), CellVoltage/CellSelectModule (R54_CellVoltage_CellSelectModule#17.1), CellVoltage/CellSelectModule (R54_CellVoltage_CellSelectModule#18.1), CellVoltage/CellSelectModule (R54_CellVoltage_CellSelectModule#19.1), CellVoltage/CellSelectModule (R54_CellVoltage_CellSelectModule#20.1), CellVoltage/CellSelectModule (R54_CellVoltage_CellSelectModule#21.1), CellVoltage/CellSelectModule (R54_CellVoltage_CellSelectModule#22.1), CellVoltage/CellSelectModule (R54_CellVoltage_CellSelectModule#23.1), CellVoltage/CellSelectModule (R54_CellVoltage_CellSelectModule#24.1)
Vcc: MainBoard (10 pins), MainShunt (14 pins)
Vcc_F: DiffAmp_K-0.2 (U1.4), DiffAmp_K-10 (U2.4), MainBoard (C11.1 L2.1), Voltmetr (U2_Voltmetr.4 U8_Voltmetr.4 U9_Voltmetr.4), CellVoltage/Voltmetr (U2_CellVoltage_Voltmetr.4 U8_CellVoltage_Voltmetr.4 U9_CellVoltage_Voltmetr.4)
Cell-1: CellVoltageControl (P1.1), CellVoltage/CellSelectModule (Q5_CellVoltage_CellSelectModule#1.2)
Cell-2: CellVoltageControl (P1.2), CellVoltage/CellSelectModule (Q5_CellVoltage_CellSelectModule#2.2)
Cell-3: CellVoltageControl (P1.3), CellVoltage/CellSelectModule (Q5_CellVoltage_CellSelectModule#3.2)
Cell-4: CellVoltageControl (P1.4), CellVoltage/CellSelectModule (Q5_CellVoltage_CellSelectModule#4.2)
Cell-5: CellVoltageControl (P1.5), CellVoltage/CellSelectModule (Q5_CellVoltage_CellSelectModule#5.2)
Cell-6: CellVoltageControl (P1.6), CellVoltage/CellSelectModule (Q5_CellVoltage_CellSelectModule#6.2)
Cell-7: CellVoltageControl (P1.7), CellVoltage/CellSelectModule (Q5_CellVoltage_CellSelectModule#7.2)
Cell-8: CellVoltageControl (P1.8), CellVoltage/CellSelectModule (Q5_CellVoltage_CellSelectModule#8.2)
Cell-9: CellVoltageControl (P1.9), CellVoltage/CellSelectModule (Q5_CellVoltage_CellSelectModule#9.2)
Cell-10: CellVoltageControl (P1.10), CellVoltage/CellSelectModule (Q5_CellVoltage_CellSelectModule#10.2)
Cell-11: CellVoltageControl (P1.11), CellVoltage/CellSelectModule (Q5_CellVoltage_CellSelectModule#11.2)
Cell-12: CellVoltageControl (P1.12), CellVoltage/CellSelectModule (Q5_CellVoltage_CellSelectModule#12.2)
Cell-13: CellVoltageControl (P1.13), CellVoltage/CellSelectModule (Q5_CellVoltage_CellSelectModule#13.2)
Cell-14: CellVoltageControl (P1.14), CellVoltage/CellSelectModule (Q5_CellVoltage_CellSelectModule#14.2)
Cell-15: CellVoltageControl (P1.15), CellVoltage/CellSelectModule (Q5_CellVoltage_CellSelectModule#15.2)
Cell-16: CellVoltageControl (P1.16), CellVoltage/CellSelectModule (Q5_CellVoltage_CellSelectModule#16.2)
Cell-17: CellVoltageControl (P1.17), CellVoltage/CellSelectModule (Q5_CellVoltage_CellSelectModule#17.2)
Cell-18: CellVoltageControl (P1.18), CellVoltage/CellSelectModule (Q5_CellVoltage_CellSelectModule#18.2)
Cell-19: CellVoltageControl (P1.19), CellVoltage/CellSelectModule (Q5_CellVoltage_CellSelectModule#19.2)
Cell-20: CellVoltageControl (P1.20), CellVoltage/CellSelectModule (Q5_CellVoltage_CellSelectModule#20.2)
Cell-21: CellVoltageControl (P1.21), CellVoltage/CellSelectModule (Q5_CellVoltage_CellSelectModule#21.2)
Cell-22: CellVoltageControl (P1.22), CellVoltage/CellSelectModule (Q5_CellVoltage_CellSelectModule#22.2)
Cell-23: CellVoltageControl (P1.23), CellVoltage/CellSelectModule (Q5_CellVoltage_CellSelectModule#23.2)
Cell-24: CellVoltageControl (P1.24), CellVoltage/CellSelectModule (Q5_CellVoltage_CellSelectModule#24.2)
V+: CellVoltage/Voltmetr (Q4_CellVoltage_Voltmetr.2 R35_CellVoltage_Voltmetr.2), CellVoltage/CellSelectModule (Q5_CellVoltage_CellSelectModule#1.3), CellVoltage/CellSelectModule (Q5_CellVoltage_CellSelectModule#2.3), CellVoltage/CellSelectModule (Q5_CellVoltage_CellSelectModule#3.3), CellVoltage/CellSelectModule (Q5_CellVoltage_CellSelectModule#4.3), CellVoltage/CellSelectModule (Q5_CellVoltage_CellSelectModule#5.3), CellVoltage/CellSelectModule (Q5_CellVoltage_CellSelectModule#6.3), CellVoltage/CellSelectModule (Q5_CellVoltage_CellSelectModule#7.3), CellVoltage/CellSelectModule (Q5_CellVoltage_CellSelectModule#8.3), CellVoltage/CellSelectModule (Q5_CellVoltage_CellSelectModule#9.3), CellVoltage/CellSelectModule (Q5_CellVoltage_CellSelectModule#10.3), CellVoltage/CellSelectModule (Q5_CellVoltage_CellSelectModule#11.3), CellVoltage/CellSelectModule (Q5_CellVoltage_CellSelectModule#12.3), CellVoltage/CellSelectModule (Q5_CellVoltage_CellSelectModule#13.3), CellVoltage/CellSelectModule (Q5_CellVoltage_CellSelectModule#14.3), CellVoltage/CellSelectModule (Q5_CellVoltage_CellSelectModule#15.3), CellVoltage/CellSelectModule (Q5_CellVoltage_CellSelectModule#16.3), CellVoltage/CellSelectModule (Q5_CellVoltage_CellSelectModule#17.3), CellVoltage/CellSelectModule (Q5_CellVoltage_CellSelectModule#18.3), CellVoltage/CellSelectModule (Q5_CellVoltage_CellSelectModule#19.3), CellVoltage/CellSelectModule (Q5_CellVoltage_CellSelectModule#20.3), CellVoltage/CellSelectModule (Q5_CellVoltage_CellSelectModule#21.3), CellVoltage/CellSelectModule (Q5_CellVoltage_CellSelectModule#22.3), CellVoltage/CellSelectModule (Q5_CellVoltage_CellSelectModule#23.3), CellVoltage/CellSelectModule (Q5_CellVoltage_CellSelectModule#24.3)